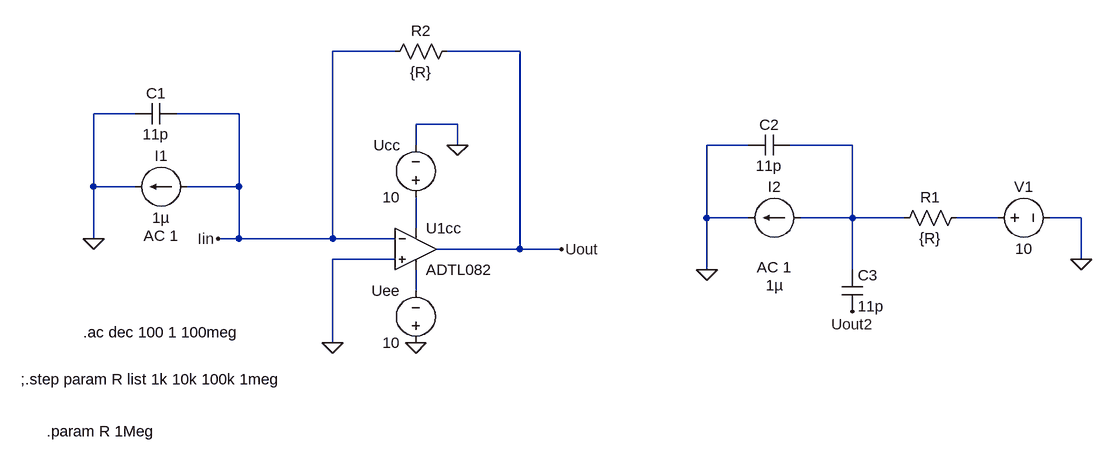
[diagram p0: schematic pd_z2.asc]
pd_z2.asc, the LTspice schematic file:
Version 4
SHEET 1 1236 680
WIRE 160 -128 64 -128
WIRE 352 -128 240 -128
WIRE -240 -32 -304 -32
WIRE -80 -32 -176 -32
WIRE 256 -16 192 -16
WIRE 192 16 192 -16
WIRE 256 16 256 -16
WIRE 704 16 640 16
WIRE 864 16 768 16
WIRE -304 80 -304 -32
WIRE -240 80 -304 80
WIRE -80 80 -80 -32
WIRE -80 80 -160 80
WIRE 640 128 640 16
WIRE 704 128 640 128
WIRE 864 128 864 16
WIRE 864 128 784 128
WIRE 944 128 864 128
WIRE 1088 128 1024 128
WIRE 1216 128 1168 128
WIRE 192 144 192 96
WIRE -304 160 -304 80
WIRE -80 160 -80 80
WIRE -80 160 -112 160
WIRE 64 160 64 -128
WIRE 64 160 -80 160
WIRE 160 160 64 160
WIRE 352 176 352 -128
WIRE 352 176 224 176
WIRE 416 176 352 176
WIRE 160 192 64 192
WIRE 1216 192 1216 128
WIRE 640 208 640 128
WIRE 864 208 864 128
WIRE 192 240 192 208
WIRE 64 320 64 192
FLAG 256 16 0
FLAG 192 320 0
FLAG 416 176 Uout
FLAG -112 160 Iin
FLAG 64 320 0
FLAG -304 160 0
FLAG 640 208 0
FLAG 1216 192 0
FLAG 864 272 Uout2
SYMBOL OpAmps\\ADTL082 192 112 R0
SYMATTR InstName U1cc
SYMBOL voltage 192 336 R180
WINDOW 0 24 96 Left 2
WINDOW 3 24 16 Left 2
SYMATTR InstName Uee
SYMATTR Value 10
SYMBOL voltage 192 112 R180
WINDOW 0 24 96 Left 2
WINDOW 3 24 16 Left 2
SYMATTR InstName Ucc
SYMATTR Value 10
SYMBOL res 256 -144 R90
WINDOW 0 0 56 VBottom 2
WINDOW 3 32 56 VTop 2
SYMATTR InstName R2
SYMATTR Value {R}
SYMBOL cap -176 -48 R90
WINDOW 0 0 32 VBottom 2
WINDOW 3 32 32 VTop 2
SYMATTR InstName C1
SYMATTR Value 11p
SYMBOL current 784 128 R90
WINDOW 0 -32 40 VBottom 2
WINDOW 3 88 40 VTop 2
WINDOW 123 60 40 VTop 2
WINDOW 39 0 0 Left 0
SYMATTR InstName I2
SYMATTR Value 1µ
SYMATTR Value2 AC 1
SYMBOL cap 768 0 R90
WINDOW 0 0 32 VBottom 2
WINDOW 3 32 32 VTop 2
SYMATTR InstName C2
SYMATTR Value 11p
SYMBOL res 1040 112 R90
WINDOW 0 0 56 VBottom 2
WINDOW 3 32 56 VTop 2
SYMATTR InstName R1
SYMATTR Value {R}
SYMBOL voltage 1072 128 R270
WINDOW 0 32 56 VTop 2
WINDOW 3 -32 56 VBottom 2
SYMATTR InstName V1
SYMATTR Value 10
SYMBOL cap 848 208 R0
SYMATTR InstName C3
SYMATTR Value 11p
SYMBOL current -160 80 R90
WINDOW 0 -32 40 VBottom 2
WINDOW 3 32 40 VTop 2
WINDOW 123 60 40 VTop 2
WINDOW 39 0 0 Left 0
SYMATTR InstName I1
SYMATTR Value 1µ
SYMATTR Value2 AC 1
TEXT -320 304 Left 2 !.ac dec 100 1 100meg
TEXT -416 376 Left 2 !;.step param R list 1k 10k 100k 1meg
TEXT -376 456 Left 2 !.param R 1Meg

The netlist it stands for:
* pd_z2.asc
XU1cc 0 Iin N003 N004 Uout ADTL082  ; pins In+ In- V+ V- OUT
V§Uee 0 N004 10
V§Ucc N003 0 10
R2 Uout Iin {R}
C1 Iin 0 11p
I2 N001 0 1µ AC 1
C2 N001 0 11p
R1 N002 N001 {R}
V1 N002 0 10
C3 N001 Uout2 11p
I1 Iin 0 1µ AC 1
.ac dec 100 1 100meg
;.step param R list 1k 10k 100k 1meg
.param R 1Meg
.lib ADI.lib
.backanno
.end